# EAGLE design CP2102 (EAGLE 7.4.0)
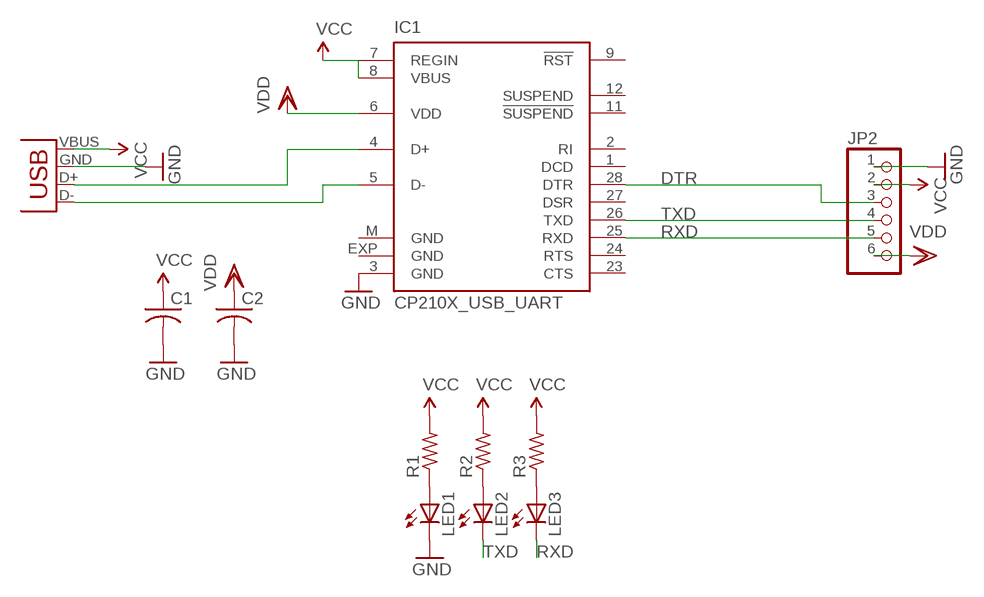
[diagram p0: schematic, sheet 1]

## Parts
C1  C-USC1206  [C1206]
C2  C-USC1206  [C1206]
IC1  CP210X_USB_UART  [MLP28]
JP1  USB-A-H  [USB-A-H]
JP2  PINHD-1X6  [1X06]
LED1  LEDCHIPLED_0805  [CHIPLED_0805]
LED2  LEDCHIPLED_0805  [CHIPLED_0805]
LED3  LEDCHIPLED_0805  [CHIPLED_0805]
R1  R-US_M0805  [M0805]
R2  R-US_M0805  [M0805]
R3  R-US_M0805  [M0805]

## Nets
DTR: IC1.28(DTR) JP2.3
GND: C1.2 C2.2 IC1.3(GND) JP1.GND(VBUS) JP2.1 LED1.C
N$1: LED3.A R3.1
N$2: LED2.A R2.1
N$3: LED1.A R1.1
N$4: IC1.4(D+) JP1.D+(D-)
N$5: IC1.5(D-) JP1.D-(D+)
RXD: IC1.25(RXD) JP2.5 LED3.C
TXD: IC1.26(TXD) JP2.4 LED2.C
VCC: C1.1 IC1.7(REGIN) IC1.8(VBUS) JP1.VBUS(GND) JP2.2 R1.2 R2.2 R3.2
VDD: C2.1 IC1.6(VDD) JP2.6
Unconnected: IC1.1(DCD) IC1.2(RI) IC1.9(!RST) IC1.11(!SUSPEND) IC1.12(SUSPEND) IC1.23(CTS) IC1.24(RTS) IC1.27(DSR)

## Power pins joined to a net without a drawn wire
GND: IC1.EXP(GND) IC1.M(GND)

## Library data of the parts
C1 C2 = adafruit:C-US: CAPACITOR, American symbol
IC1 = SparkFun-DigitalIC:CP210X_USB_UART: Single-Chip USB to UART Bridge Source: www.silabs.com .. CP2101.pdf / cp2102.pdf. Spark Fun Electronics SKU : COM-00310
JP1 = SparkFun-Connectors:USB: USB Connectors USB-B-PTH is fully proven SKU : PRT-00139/CONN-08278 USB-miniB is fully proven SKU : PRT-00587 USB-A-PCB is untested. USB-A-H is throughly reviewed, but untested. Spark Fun Electronics SKU : PRT-00437 USB-B-SMT is throughly reviewed, but untested. Needs silkscreen touching up. USB-A-S has not been used/tested USB-MB-H has not been used/tested USB-MICROB has been used. CONN-09505
JP2 = pinhead:PINHD-1X6: PIN HEADER
LED1-LED3 = adafruit:LED: LED OSRAM: - CHIPLED LG R971, LG N971, LY N971, LG Q971, LY Q971, LO R971, LY R971 LH N974, LH R974 LS Q976, LO Q976, LY Q976 LO Q996 - Hyper CHIPLED LW Q18S LB Q993, LB Q99A, LB R99A - SideLED LS A670, LO A670, LY A670, LG A670, LP A670 LB A673, LV A673, LT A673, LW A673 LH A674 LY A675 LS A676, LA A676, LO A676, LY A676, LW A676 LS A679, LY A679, LG A679 - Hyper Micro SIDELED® LS Y876, LA Y876, LO Y876, LY Y876 LT Y87S - SmartLED LW L88C, LW L88S LB L89C, LB L89S, LG L890 LS L89K, LO L89K, LY L89K LS L896, LA L896, LO L896, LY L896 - TOPLED LS T670, LO T670, LY T670, LG T670, LP T670 LSG T670, LSP T670, LSY T670, LOP T670, LYG T670 LG T671, LOG T671, LSG T671 LB T673, LV T673, LT T673, LW T673 LH T674 LS T676, LA T676, LO T676, LY T676, LB T676, LH T676, LSB T676, LW T676 LB T67C, LV T67C, LT T67C, LS T67K, LO T67K, LY T67K, LW E67C LS E67B, LA E67B, LO E67B, LY E67B, LB E67C, LV E67C, LT E67C LW T67C LS T679, LY T679, LG T679 LS T770, LO T770, LY T770, LG T770, LP T770 LB T773, LV T773, LT T773, LW T773 LH T774 LS E675, LA E675, LY E675, LS T675 LS T776, LA T776, LO T776, LY T776, LB T776 LHGB T686 LT T68C, LB T68C - Hyper Mini TOPLED® LB M676 - Mini TOPLED Santana® LG M470 LS M47K, LO M47K, LY M47K Source: http://www.osram.convergy.de/
R1-R3 = adafruit:R-US_: RESISTOR, American symbol

## Board
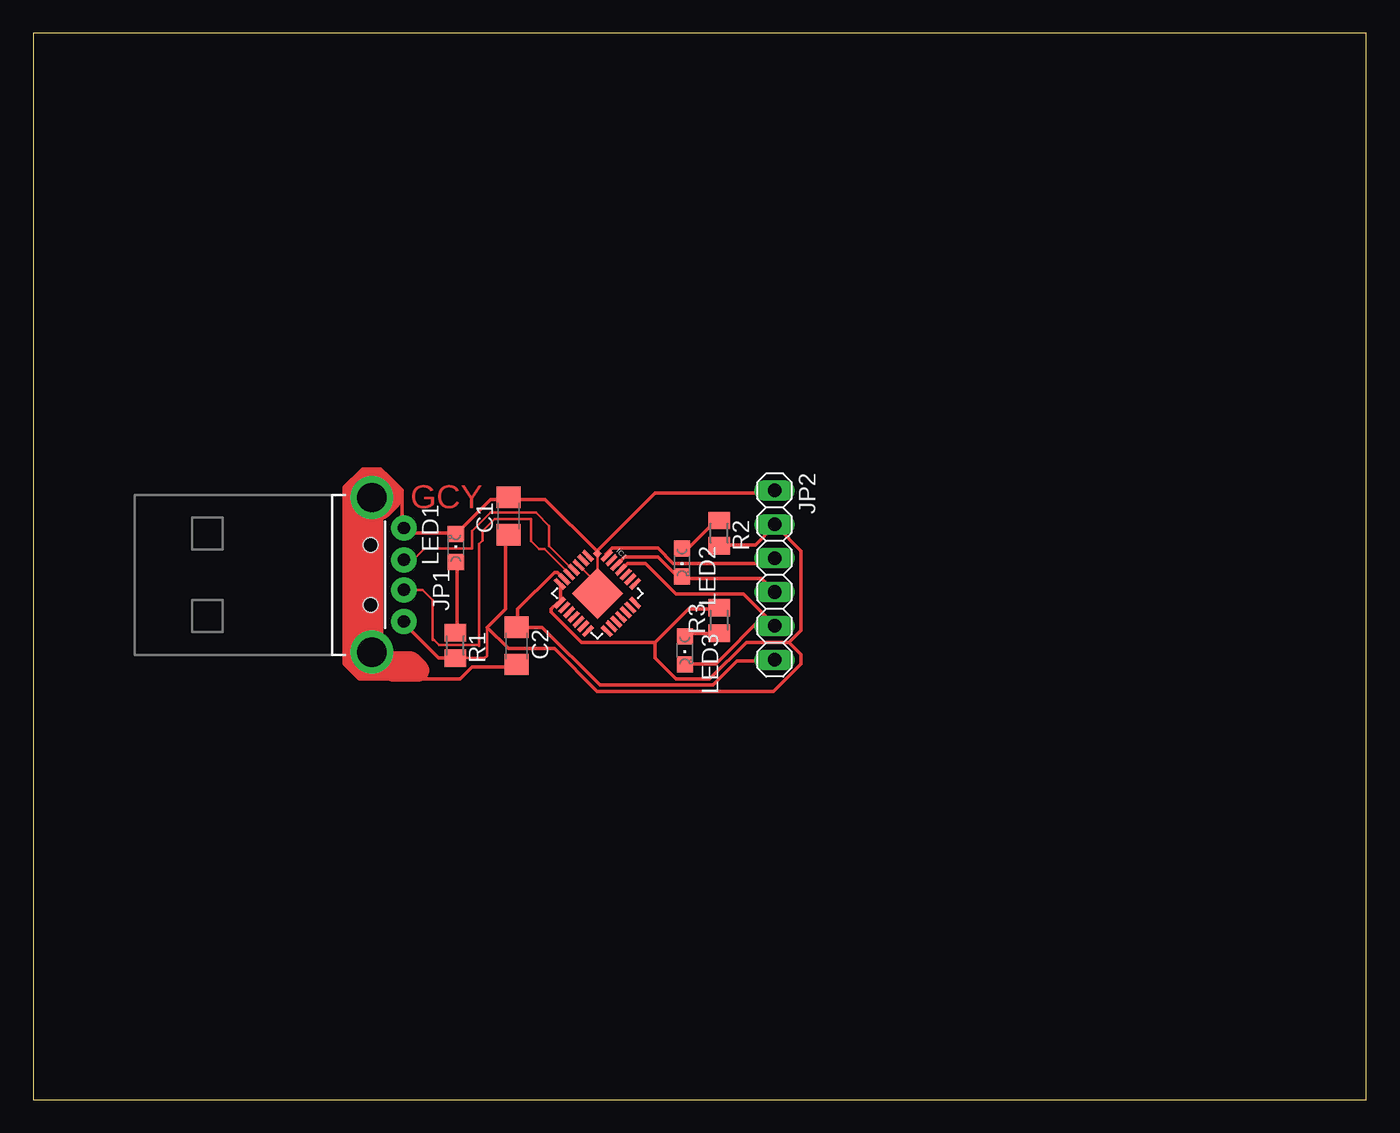
[diagram p1: board, top side]

Size 100 x 80 mm. Coordinates in mm from the lower left corner, seen from the top.
Outline: 0,0 100,0 100,80 0,80 0,0
Copper layers (1*16): Top 0.035mm / dielectric 1.5mm / Bottom 0.035mm
Design rules "default": minimum track width 10mil, minimum drill 24mil, track to track 8mil, track to pad 8mil, pad to pad 8mil, via to via 8mil, smd to smd 8mil, copper to edge 40mil, drill to drill 8mil, minimum pad ring 10mil, minimum via ring 8mil, stop-mask expansion 4mil, vias tented up to drill 0mil, thermal gap 10mil

### Footprints (pad centres in the part's own frame; a part is rotated, then mirrored left to right if it is on the bottom)
C1206 = smd 1.6 x 1.8: 1 -1.4,0; 2 1.4,0
MLP28 = smd 1 x 0.3: 1 -2.5,1.5; 2 -2.5,1; 3 -2.5,0.5; 4 -2.5,0; 5 -2.5,-0.5; 6 -2.5,-1; 7 -2.5,-1.5; 15 2.5,-1.5; 16 2.5,-1; 17 2.5,-0.5; 18 2.5,0; 19 2.5,0.5; 20 2.5,1; 21 2.5,1.5 | smd 0.3 x 1: 8 -1.5,-2.5; 9 -1,-2.5; 10 -0.5,-2.5; 11 0,-2.5; 12 0.5,-2.5; 13 1,-2.5; 14 1.5,-2.5; 22 1.5,2.5; 23 1,2.5; 24 0.5,2.5; 25 0,2.5; 26 -0.5,2.5; 27 -1,2.5; 28 -1.5,2.5 | smd 2.7 x 2.7: EXP 0,0 | smd 0.435 x 0.435: M -2.103,2.103
USB-A-H = drill 0.914 pad 1.88: D+ 2.4,1.127; D- 2.4,-1.127; GND 2.4,3.5; VBUS 2.4,-3.5 | drill 2.2: GND2 0,-5.8; GND3 0,5.8 | hole 1.1: -0.1,2.25; -0.1,-2.25
1X06 = drill 1.016 long: 1 -6.35,0; 2 -3.81,0; 3 -1.27,0; 4 1.27,0; 5 3.81,0; 6 6.35,0
CHIPLED_0805 = smd 1.2 x 1.2: A 0,-1.05; C 0,1.05
M0805 = smd 1.3 x 1.6: 1 -0.95,0; 2 0.95,0

### Placement (x,y rotation side)
C1  35.66,43.78 90 top
C2  36.26,34.04 270 top
IC1  42.32,37.98 315 top
JP1  25.4,39.37 0 top
JP2  55.61,39.35 270 top
LED1  31.7,41.37 0 top
LED2  48.67,40.3 180 top
LED3  48.88,33.7 180 top
R1  31.66,34.07 270 top
R2  51.45,42.5 270 top
R3  51.45,35.95 90 top

### Tracks (layer width: path | path; a pad name or v marks a point on that pad's centre or on a via)
DTR
  Top 0.254: IC1.28 42.98,40.92 43.43,41.38 46.86,41.38 48.01,40.23 55.32,40.23 55.55,40.46 JP2.3
GND
  Top 0.2: IC1.M 42.3,38.6 IC1.EXP 42.32,38.69 IC1.3
  Top 0.254: LED1.C 31.55,42.52 28.12,42.52 27.89,42.75 JP1.GND 27.66,42.98 27.66,45.72 26.06,47.32 24.69,47.32 23.32,45.95 23.32,32.69 24.46,31.55 32,31.55 32.92,32.46 36.12,32.46 C2.2 | 42.29,41.15 38.41,45.03 35.66,45.03 C1.2 35.43,45.03 34.31,45.03 LED1.C | 42.29,41.15 46.63,45.49 55.55,45.49 JP2.1 | 42.29,41.15 IC1.M | 31.77,42.52 LED1.C
N$1
  Top 0.254: LED3.A 48.92,34.98 51.44,34.98 R3.1
N$2
  Top 0.254: LED2.A 48.69,41.38 49.15,41.38 51.44,43.66 R2.1
N$3
  Top 0.254: LED1.A 31.77,40.23 31.77,35.2 R1.1
N$4
  Top 0.2: IC1.4 40.5,39.75 38.7,41.55 38.7,43.05 37.7,44.05 34.3,44.05 32.9,42.65 32.9,41.35 29.35,41.35 28.5,40.5 JP1.D+
N$5
  Top 0.2: IC1.5 40.2,39.45 38.35,41.3 37.95,41.3 37.35,41.9 37.35,43.55 34.6,43.55 33.7,42.65 33.7,41.95 33.45,41.7 33.45,34.05 33.4,34.1 30.45,34.1 30.05,34.5 29.95,34.5 29.95,37.5 29.21,38.24 JP1.D-
N$6
  Top 1.676: 25.25,43.5 25.25,35.1 25.3,35.05
N$7
  Top 1.676: 24.15,34.4 24.15,45.5 25.05,46.4
N$8
  Top 1.676: 24.05,33.95 24.05,33.25 24.9,32.4 26,32.4 26.1,32.3 26.1,33.45 25.4,34.15 25.4,46.15 25.75,46.5 25.85,46.5 26.8,45.55 26.8,45.1 26.05,44.35
N$9
  Top 1.676: 27.05,32.8 28.25,32.8 28.85,32.2 27,32.2 26.9,32.3
RXD
  Top 0.254: 54.86,36.35 55.55,35.66 JP2.5 | 54.86,36.35 53.26,37.95 48.23,37.95 45.95,40.23 44.58,40.23 44.12,39.78 IC1.25 | 54.86,36.35 51.21,32.69 48.92,32.69 LED3.C
TXD
  Top 0.254: IC1.26 43.89,40.23 44.35,40.69 46.86,40.69 48.46,39.09 LED2.C 48.69,39.09 54.63,39.09 55.55,38.18 JP2.4
VCC
  Top 0.2: 34.06,35.43 34.05,35.42 34.05,33.3 33.87,33.12 R1.2
  Top 0.254: JP1.VBUS 27.89,35.66 30.4,33.15 31.55,33.15 R1.2 31.77,33.15 | C1.1 35.43,42.29 35.43,36.8 34.06,35.43 35.66,33.83 39.09,33.83 42.29,30.63 55.55,30.63 57.61,32.69 57.61,33.38 56.69,34.29 | R2.2 51.66,41.6 54.18,41.6 55.55,42.98 JP2.2 55.78,42.98 57.61,41.15 57.61,35.2 56.69,34.29 | IC1.7 39.55,38.63 39.55,37.49 IC1.8 39.32,37.26 38.86,36.8 38.86,36.58 41.15,34.29 46.63,34.29 | 46.63,34.29 49.15,36.8 51.44,36.8 R3.2 | 56.69,34.29 53.49,34.29 50.75,31.55 48.23,31.55 46.63,33.15 46.63,34.29
VDD
  Top 0.254: IC1.6 39.78,39.09 39.32,39.55 39.09,39.55 36.35,36.8 36.35,35.66 C2.1 36.35,35.43 38.18,35.43 42.52,31.09 50.98,31.09 52.81,32.92 55.55,32.92 JP2.6

### Text on the board
Top: GCY